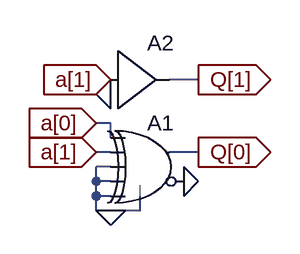
[diagram p0: schematic bin2gray_2bit.asc]
bin2gray_2bit.asc, the LTspice schematic file:
Version 4
SHEET 1 880 680
WIRE 240 80 208 80
WIRE 144 128 128 128
WIRE 144 144 144 128
WIRE 144 160 128 160
WIRE 240 160 208 160
WIRE 144 176 128 176
WIRE 128 192 128 176
WIRE 144 192 128 192
WIRE 128 208 128 192
WIRE 144 208 128 208
WIRE 128 224 128 208
WIRE 144 224 128 224
WIRE 176 224 176 208
WIRE 176 224 144 224
FLAG 144 224 0
FLAG 144 96 0
FLAG 224 192 0
FLAG 144 80 a[1]
IOPIN 144 80 In
FLAG 128 160 a[1]
IOPIN 128 160 In
FLAG 128 128 a[0]
IOPIN 128 128 In
FLAG 240 160 Q[0]
IOPIN 240 160 Out
FLAG 240 80 Q[1]
IOPIN 240 80 Out
SYMBOL Digital\\xor 192 112 R0
SYMATTR InstName A1
SYMBOL Digital\\buf1 144 16 R0
SYMATTR InstName A2

The netlist it stands for:
* bin2gray_2bit.asc
A1 a[0] a[1] 0 0 0 0 Q[0] 0 XOR
A2 a[1] 0 0 0 0 0 Q[1] 0 BUF
.backanno
.end